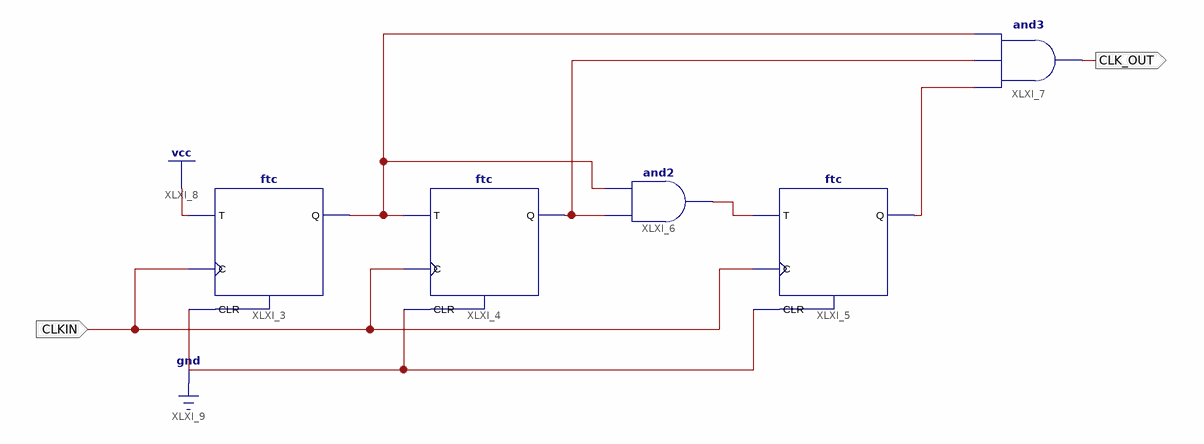
[diagram p0: schematic sheet 1]
// Xilinx ISE schematic Div8.sch (spartan6) as structural Verilog: 5 symbols, 2 ports
module Div8 (
  input  CLKIN,
  output CLK_OUT
);

  wire XLXN_3, XLXN_4, XLXN_6, XLXN_7;

  ftc XLXI_3 (.C(CLKIN), .CLR(1'b0), .T(1'b1), .Q(XLXN_7));
  ftc XLXI_4 (.C(CLKIN), .CLR(1'b0), .T(XLXN_7), .Q(XLXN_6));
  ftc XLXI_5 (.C(CLKIN), .CLR(1'b0), .T(XLXN_3), .Q(XLXN_4));
  and XLXI_6 (XLXN_3, XLXN_6, XLXN_7);
  and XLXI_7 (CLK_OUT, XLXN_4, XLXN_6, XLXN_7);
endmodule
